# Altium schematic sheet Power.SchDoc
size A
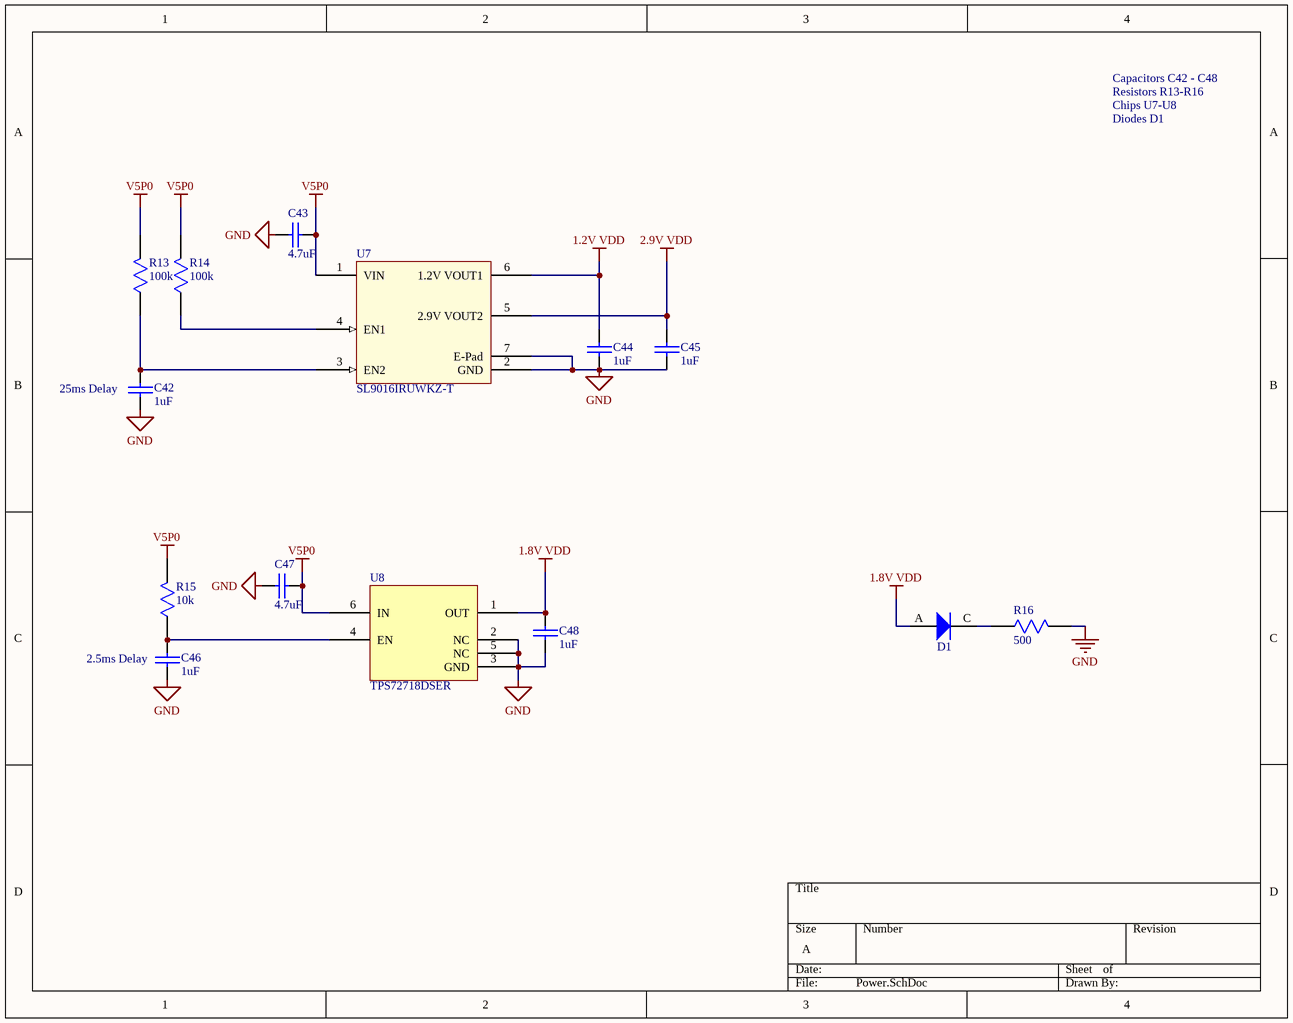
[diagram p0: Power.SchDoc]

## Parts
C42  1uF  [SMD CAP 0402]
C43  4.7uF  [SMD CAP 0402]
C44  1uF  [SMD CAP 0402]
C45  1uF  [SMD CAP 0402]
C46  1uF  [SMD CAP 0402]
C47  4.7uF  [SMD CAP 0402]
C48  1uF  [SMD CAP 0402]
D1  LED 0603  [LED_0603]  (value not drawn)
R13  100k  [SMD RES 0402]
R14  100k  [SMD RES 0402]
R15  10k  [SMD RES 0402]
R16  500  [SMD RES 0402]
U7  SL9016IRUWKZ-T  [UTDFN]
U8  TPS72718DSER  [DSE]

## Nets
1.2V VDD: C44.0 U7.6(1.2V_VOUT1)
1.8V VDD: C48.1 D1.A U8.1(OUT)
2.9V VDD: C45.0 U7.5(2.9V_VOUT2)
GND: C42.1 C43.1 C44.1 C45.1 C46.1 C47.0 C48.0 R16.1 U7.2(GND) U7.7(E-Pad) U8.2(NC) U8.3(GND) U8.5(NC)
V5P0: C43.0 C47.1 R13.1 R14.1 R15.1 U7.1(VIN) U8.6(IN)
NetC42_0: C42.0 R13.0 U7.3(EN2)
NetC46_0: C46.0 R15.0 U8.4(EN)
NetD1_C: D1.C R16.0
NetR14_0: R14.0 U7.4(EN1)

## Notes on the sheet
- Capacitors C42 - C48
- Resistors R13-R16
- Chips U7-U8
- Diodes D1
- (near C42) 25ms Delay
- (near C46) 2.5ms Delay

## Library data of the parts
C42-C48 = Capacitor: Value: C?
D1 = LED 0603: LTST_C195TBJRKT
R13-R16 = Resistor: Value: ?
U8 = TPS72718DSER: Single 1.8V Linear Regulator